# Altium schematic sheet STM32G473RET6_PINOUT.SchDoc
size B; SheetNumber: 7; SheetTotal: 7
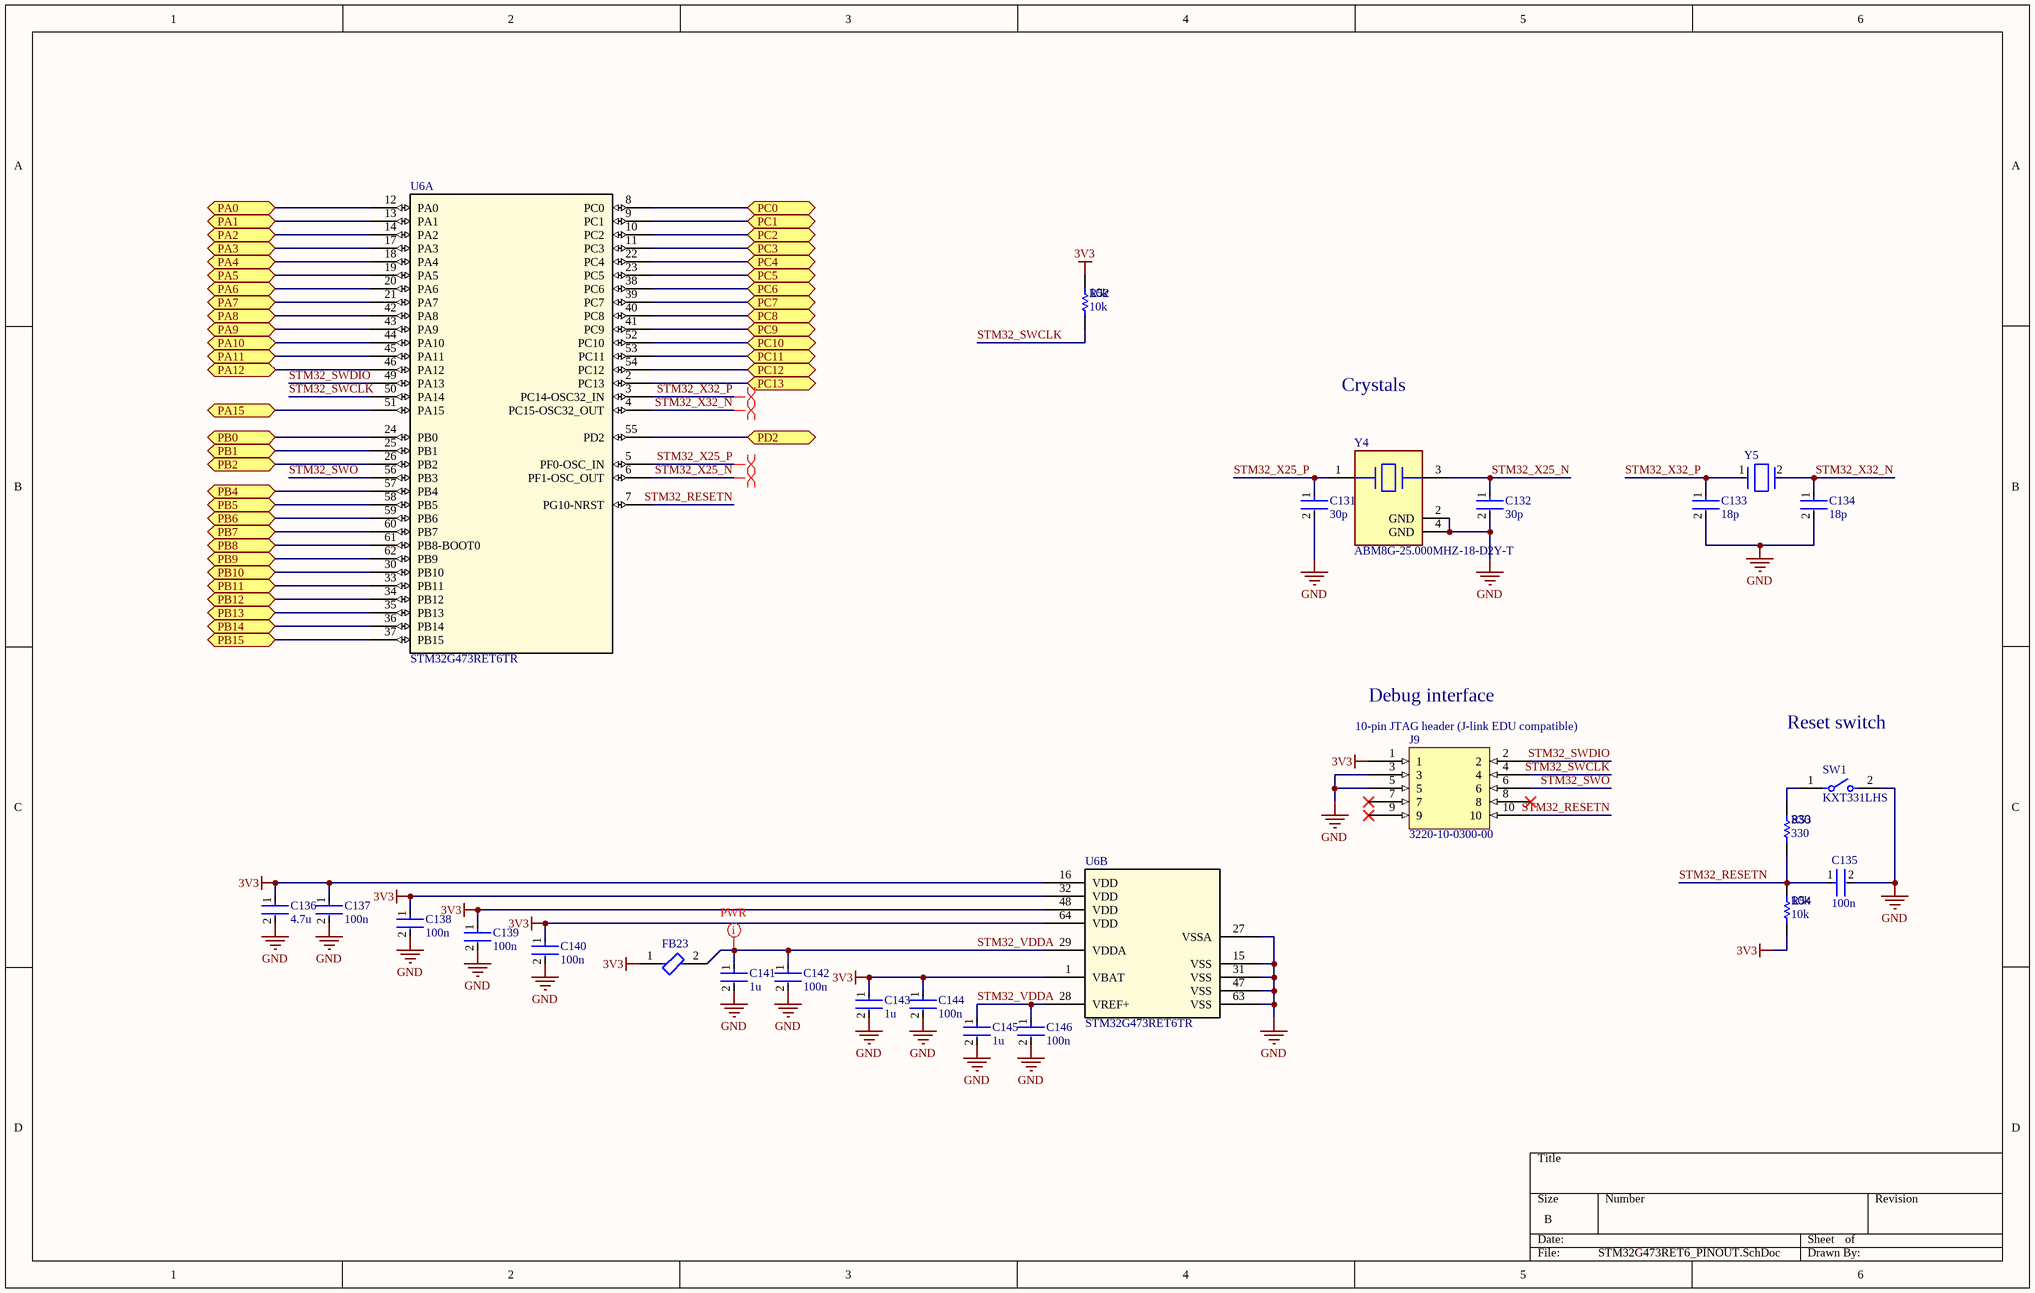
[diagram p0: STM32G473RET6_PINOUT.SchDoc]

## Parts
C131  30p  [FP-0402-L_1_0_0_05-W_0_5-IPC_A]
C132  30p  [FP-0402-L_1_0_0_05-W_0_5-IPC_A]
C133  18p  [FP-0402-L_1_0_0_05-W_0_5-IPC_A]
C134  18p  [FP-0402-L_1_0_0_05-W_0_5-IPC_A]
C135  100n  [FP-0402-L_1_0_0_05-W_0_5-IPC_A]
C136  4.7u  [FP-0402-L_1_0_0_05-W_0_5-IPC_A]
C137  100n  [FP-0402-L_1_0_0_05-W_0_5-IPC_A]
C138  100n  [FP-0402-L_1_0_0_05-W_0_5-IPC_A]
C139  100n  [FP-0402-L_1_0_0_05-W_0_5-IPC_A]
C140  100n  [FP-0402-L_1_0_0_05-W_0_5-IPC_A]
C141  1u  [FP-0402-L_1_0_0_05-W_0_5-IPC_A]
C142  100n  [FP-0402-L_1_0_0_05-W_0_5-IPC_A]
C143  1u  [FP-0402-L_1_0_0_05-W_0_5-IPC_A]
C144  100n  [FP-0402-L_1_0_0_05-W_0_5-IPC_A]
C145  1u  [FP-0402-L_1_0_0_05-W_0_5-IPC_A]
C146  100n  [FP-0402-L_1_0_0_05-W_0_5-IPC_A]
FB23  BLM18KG331SH1D  [FP-BLM18-0_15-t0_8-IPC_B]  (value not drawn)
J9  3220-10-0300-00  [3220-10-0300-00-Footprint-1]
R52  10k  [R0603B]
R53  330  [R0603B]
R54  10k  [R0603B]
SW1  KXT331LHS  [FP-KXT331LHS-MFG]
U6  STM32G473RET6TR  [STM32G473RET6TR-Footprint-1]  (parts A,B of 2)
Y4  ABM8G-25.000MHZ-18-D2Y-T  [FP-ABM8G-MFG]
Y5  ECS-.327-12.5-1210-TR  [FP-ECX-1210-MFG]  (value not drawn)

## Ports
PA0 (bidir), PA1 (bidir), PA2 (bidir), PA3 (bidir), PA4 (bidir), PA5 (bidir), PA6 (bidir), PA7 (bidir), PA8 (bidir), PA9 (bidir), PA10 (bidir), PA11 (bidir), PA12 (bidir), PA15 (bidir), PB0 (bidir), PB1 (bidir), PB2 (bidir), PB4 (bidir), PB5 (bidir), PB6 (bidir), PB7 (bidir), PB8 (bidir), PB9 (bidir), PB10 (bidir), PB11 (bidir), PB12 (bidir), PB13 (bidir), PB14 (bidir), PB15 (bidir), PC0 (bidir), PC1 (bidir), PC2 (bidir), PC3 (bidir), PC4 (bidir), PC5 (bidir), PC6 (bidir), PC7 (bidir), PC8 (bidir), PC9 (bidir), PC10 (bidir), PC11 (bidir), PC12 (bidir), PC13 (bidir), PD2 (bidir)

## Nets
3V3: C136.1 C137.1 C138.1 C139.1 C140.1 C143.1 C144.1 FB23.1 J9.1 R52.2 R54.1 U6.1(VBAT) U6.16(VDD) U6.32(VDD) U6.48(VDD) U6.64(VDD)
GND: C131.2 C132.2 C133.2 C134.2 C135.2 C136.2 C137.2 C138.2 C139.2 C140.2 C141.2 C142.2 C143.2 C144.2 C145.2 C146.2 J9.3 J9.5 SW1.2 U6.15(VSS) U6.27(VSSA) U6.31(VSS) U6.47(VSS) U6.63(VSS) Y4.2(GND) Y4.4(GND)
PA0: U6.12(PA0) ; port PA0
PA1: U6.13(PA1) ; port PA1
PA2: U6.14(PA2) ; port PA2
PA3: U6.17(PA3) ; port PA3
PA4: U6.18(PA4) ; port PA4
PA5: U6.19(PA5) ; port PA5
PA6: U6.20(PA6) ; port PA6
PA7: U6.21(PA7) ; port PA7
PA8: U6.42(PA8) ; port PA8
PA9: U6.43(PA9) ; port PA9
PA10: U6.44(PA10) ; port PA10
PA11: U6.45(PA11) ; port PA11
PA12: U6.46(PA12) ; port PA12
PA15: U6.51(PA15) ; port PA15
PB0: U6.24(PB0) ; port PB0
PB1: U6.25(PB1) ; port PB1
PB2: U6.26(PB2) ; port PB2
PB4: U6.57(PB4) ; port PB4
PB5: U6.58(PB5) ; port PB5
PB6: U6.59(PB6) ; port PB6
PB7: U6.60(PB7) ; port PB7
PB8: U6.61(PB8-BOOT0) ; port PB8
PB9: U6.62(PB9) ; port PB9
PB10: U6.30(PB10) ; port PB10
PB11: U6.33(PB11) ; port PB11
PB12: U6.34(PB12) ; port PB12
PB13: U6.35(PB13) ; port PB13
PB14: U6.36(PB14) ; port PB14
PB15: U6.37(PB15) ; port PB15
PC0: U6.8(PC0) ; port PC0
PC1: U6.9(PC1) ; port PC1
PC2: U6.10(PC2) ; port PC2
PC3: U6.11(PC3) ; port PC3
PC4: U6.22(PC4) ; port PC4
PC5: U6.23(PC5) ; port PC5
PC6: U6.38(PC6) ; port PC6
PC7: U6.39(PC7) ; port PC7
PC8: U6.40(PC8) ; port PC8
PC9: U6.41(PC9) ; port PC9
PC10: U6.52(PC10) ; port PC10
PC11: U6.53(PC11) ; port PC11
PC12: U6.54(PC12) ; port PC12
PC13: U6.2(PC13) ; port PC13
PD2: U6.55(PD2) ; port PD2
STM32_RESETN: C135.1 J9.10 R53.1 R54.2 U6.7(PG10-NRST)
STM32_SWCLK: J9.4 R52.1 U6.50(PA14)
STM32_SWDIO: J9.2 U6.49(PA13)
STM32_SWO: J9.6 U6.56(PB3)
STM32_VDDA: C141.1 C142.1 C145.1 C146.1 FB23.2 U6.28(VREF+) U6.29(VDDA)
STM32_X25_N: C132.1 U6.6(PF1-OSC_OUT) Y4.3
STM32_X25_P: C131.1 U6.5(PF0-OSC_IN) Y4.1
STM32_X32_N: C134.1 U6.4(PC15-OSC32_OUT) Y5.2(Out/In)
STM32_X32_P: C133.1 U6.3(PC14-OSC32_IN) Y5.1(In/Out)
NetR53_2: R53.2 SW1.1

Not connected (* = marked no-connect by the designer): J9 7* 8* 9*

## Layout directives
differential pair: STM32_X25_N, STM32_X25_P, STM32_X32_N, STM32_X32_P
net class PWR: STM32_VDDA

## Notes on the sheet
- Crystals
- Debug interface
- (near J9) 10-pin JTAG header (J-link EDU compatible)
- Reset switch

## Library data of the parts
C131-C146 = CMP-001-00058-1: LARGE PADS, 0402 CAP, CHANGE COMMENT TO MATCH REAL P/N; Capacitor Type: Ceramic; Min Operating Temperature: -55°C; Mounting Technology: Surface Mount; Pins: 2; Case/Package: 0402; RoHS Compliant: Yes; Max Operating Temperature: 85°C
  C131 C132: Value: 30p
  C133 C134: Value: 18p
  C135 C137-C140 C142 C144 C146: Value: 100n
  C136: Value: 4.7u
  C141 C143 C145: Value: 1u
FB23 = CMP-06046-002069-1: Chip Ferrite Bead, 0603, 330Ω @ 100MHz, 0.08Ω, 25%, 1.7A; Number of Lines: 1; DC Resistance (DCR): 80mR; Packaging: Tape and Reel; Case/Package: 0603; Height: 0.037inch; Case Code (Metric): 1608; Length: 0.063inch; Package Quantity: 4000; Max Operating Temperature: 125°C; Case Code (Imperial): 0603; RoHS Compliant: Yes; Width: 0.032inch; Mount: Surface Mount; Min Operating Temperature: -55°C; Ratings: AEC-Q200; Max Current Rating: 1.7A
J9 = CMP-001-0013-3: CONN HEADER SMD 10POS 1.27MM
R52-R54 = CMP-009-00002-14: Resistor
  R52 R54: Value: 10k
  R53: Value: 330
SW1 = CMP-10040-000029-1: SWITCH TACTILE SPST-NO 0.02A 15V; Operating Force: 240gf; Switch Travel: 0.13mm; Illumination Type: Non-Illuminated; Throw Configuration: SPST; Number of Ports: 1; Current Rating: 5A; Mechanical Life: 500000Cycles; Switch Function: Off-Mom; Connector Type: USB; Actuator Type: Standard; Gender: Receptacle; Number of Contacts: 24; Contact Plating: Gold; Insulation Color: Black; Min Operating Temperature: -40°C; Packaging: Tape and Reel; Flammability Rating: UL94 V-0; Max Operating Temperature: 85°C; Termination: Solder; Mount: Surface Mount
U6 = CMP-020-00020-2: MCU 32-Bit STM32 ARM Cortex-M4 RISC 512KB Flash 1.71V to 3.6V 64-Pin LQFP T/R; RoHS Compliant: Yes
Y4 = CMP-2000-05733-3: Crystal 25MHz ±20ppm (Tol) ±30ppm (Stability) 18pF FUND 60Ω 4-Pin SMD T/R; Series Resistance: 60R; Length: 3.2mm; Depth: 2.5mm; Packaging: Tape and Reel; Min Operating Temperature: -40°C; Operating Frequency: 25 MHz; Lead Free: Lead Free; Number of Pins: 4; Frequency Tolerance: 20ppm; Radiation Hardening: No; Max Operating Temperature: 85°C; Termination: SMD/SMT; Frequency Stability: 30ppm; Frequency: 25MHz; Series: ABM8G; Mount: Surface Mount; Package Quantity: 1000; Height: 0.039inch; Width: 0.098inch; Case/Package: CSMD; ESR (Equivalent Series Resistance): 60R; Load Capacitance: 18pF; Tolerance: 20ppm
Y5 = CMP-40224-000006-1: CRYSTAL 32.7680KHZ 12.5PF SMD; Manufacturer: ECS International; Frequency: 32.768kHz; Esr: 90kΩ; Tolerance: 20ppm; Device Class L1: Passive Components; Load Capacitance: 12.5pF; Temperature: -40°C to +85°C; ComponentLink2URL: https://ecsxtal.com/store/pdf/ECX-1210.pdf; Series: ECX-1210; Octopart: https://octopart.com/ecs-.327-12.5-1210-tr-ecs+international-81221340; ComponentLink2Description: Datasheet; Temperature Range Low: -40°C; Digikey Description: CRYSTAL 32.7680KHZ 12.5PF SMD; Lead Free: Yes; RoHS: TRUE; Device Class L3: Crystals; Automotive: No; Category: Crys; Height: 0.5mm; Manufacturer Part Number: ECS-.327-12.5-1210-TR; Temperature Range High: +85°C; Device Class L2: Crystals / Oscillators; Package: ECX-1210